# Altium schematic sheet ESP8684H4.SchDoc
size A3; SheetNumber: 1; SheetTotal: 4
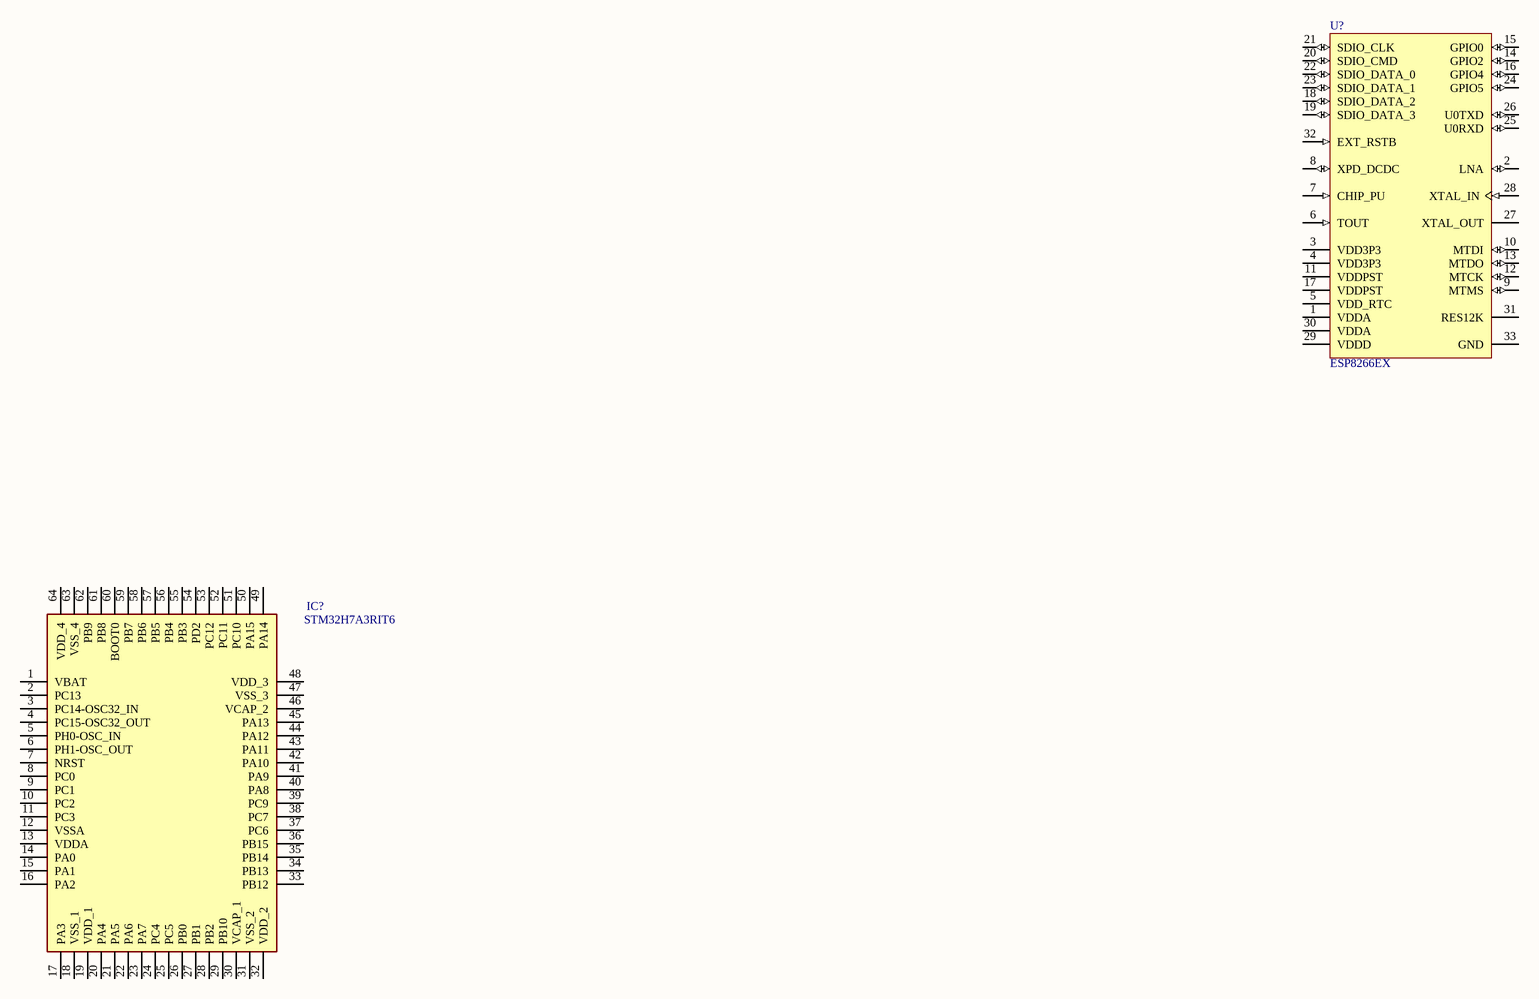
[diagram p0: ESP8684H4.SchDoc]

## Parts
IC?  STM32H7A3RIT6  [QFP50P1200X1200X160-64N]
U?  ESP8266EX  [ESFS-QFN-32_L]

## Nets

Not connected (* = marked no-connect by the designer): IC? 1(VBAT) 2(PC13) 3(PC14-OSC32_IN) 4(PC15-OSC32_OUT) 5(PH0-OSC_IN) 6(PH1-OSC_OUT) 7(NRST) 8(PC0) 9(PC1) 10(PC2) 11(PC3) 12(VSSA) 13(VDDA) 14(PA0) 15(PA1) 16(PA2) 17(PA3) 18(VSS_1) 19(VDD_1) 20(PA4) 21(PA5) 22(PA6) 23(PA7) 24(PC4) 25(PC5) 26(PB0) 27(PB1) 28(PB2) 29(PB10) 30(VCAP_1) 31(VSS_2) 32(VDD_2) 33(PB12) 34(PB13) 35(PB14) 36(PB15) 37(PC6) 38(PC7) 39(PC9) 40(PA8) 41(PA9) 42(PA10) 43(PA11) 44(PA12) 45(PA13) 46(VCAP_2) 47(VSS_3) 48(VDD_3) 49(PA14) 50(PA15) 51(PC10) 52(PC11) 53(PC12) 54(PD2) 55(PB3) 56(PB4) 57(PB5) 58(PB6) 59(PB7) 60(BOOT0) 61(PB8) 62(PB9) 63(VSS_4) 64(VDD_4); U? 1(VDDA) 2(LNA) 3(VDD3P3) 4(VDD3P3) 5(VDD_RTC) 6(TOUT) 7(CHIP_PU) 8(XPD_DCDC) 9(MTMS) 10(MTDI) 11(VDDPST) 12(MTCK) 13(MTDO) 14(GPIO2) 15(GPIO0) 16(GPIO4) 17(VDDPST) 18(SDIO_DATA_2) 19(SDIO_DATA_3) 20(SDIO_CMD) 21(SDIO_CLK) 22(SDIO_DATA_0) 23(SDIO_DATA_1) 24(GPIO5) 25(U0RXD) 26(U0TXD) 27(XTAL_OUT) 28(XTAL_IN) 29(VDDD) 30(VDDA) 31(RES12K) 32(EXT_RSTB) 33(GND)

## Library data of the parts
IC? = STM32H7A3RIT6: Integrated Circuit; Manufacturer_Name: STMicroelectronics; Datasheet Link: https://www.st.com/resource/en/datasheet/stm32h7a3ai.pdf; Height: 1.6mm; Manufacturer_Part_Number: STM32H7A3RIT6; Mouser Part Number: 511-STM32H7A3RIT6; Mouser Price/Stock: https://www.mouser.co.uk/ProductDetail/STMicroelectronics/STM32H7A3RIT6?qs=xZ%2FP%252Ba9zWqZAEQXxnLVEdg%3D%3D; Arrow Part Number: STM32H7A3RIT6; Arrow Price/Stock: https://www.arrow.com/en/products/stm32h7a3rit6/stmicroelectronics
U? = CMP-2000-07453-1: Low-Power, Highly-Integrated Wi-Fi Solution, 2.5 to 3.6 V, 80 mA, -40 to 125 degC, 32-Pin QFN; Manufacturer: Espressif Systems; Mounting Technology: SurfaceMount; Datasheet URL: http://espressif.com/sites/default/files/documentation/0a-esp8266ex_datasheet_en.pdf; Package Reference: QFN-32; Package Description: 32-Pin Quad Falt No-Lead, Body 5 x 5 mm, Pitch 0.5 mm; Manufacturer URL: http://espressif.com; Datasheet Version: Rev. 5.4, 04/2017